# EAGLE schematic ArduFocuser V0.08 (EAGLE 6.3)
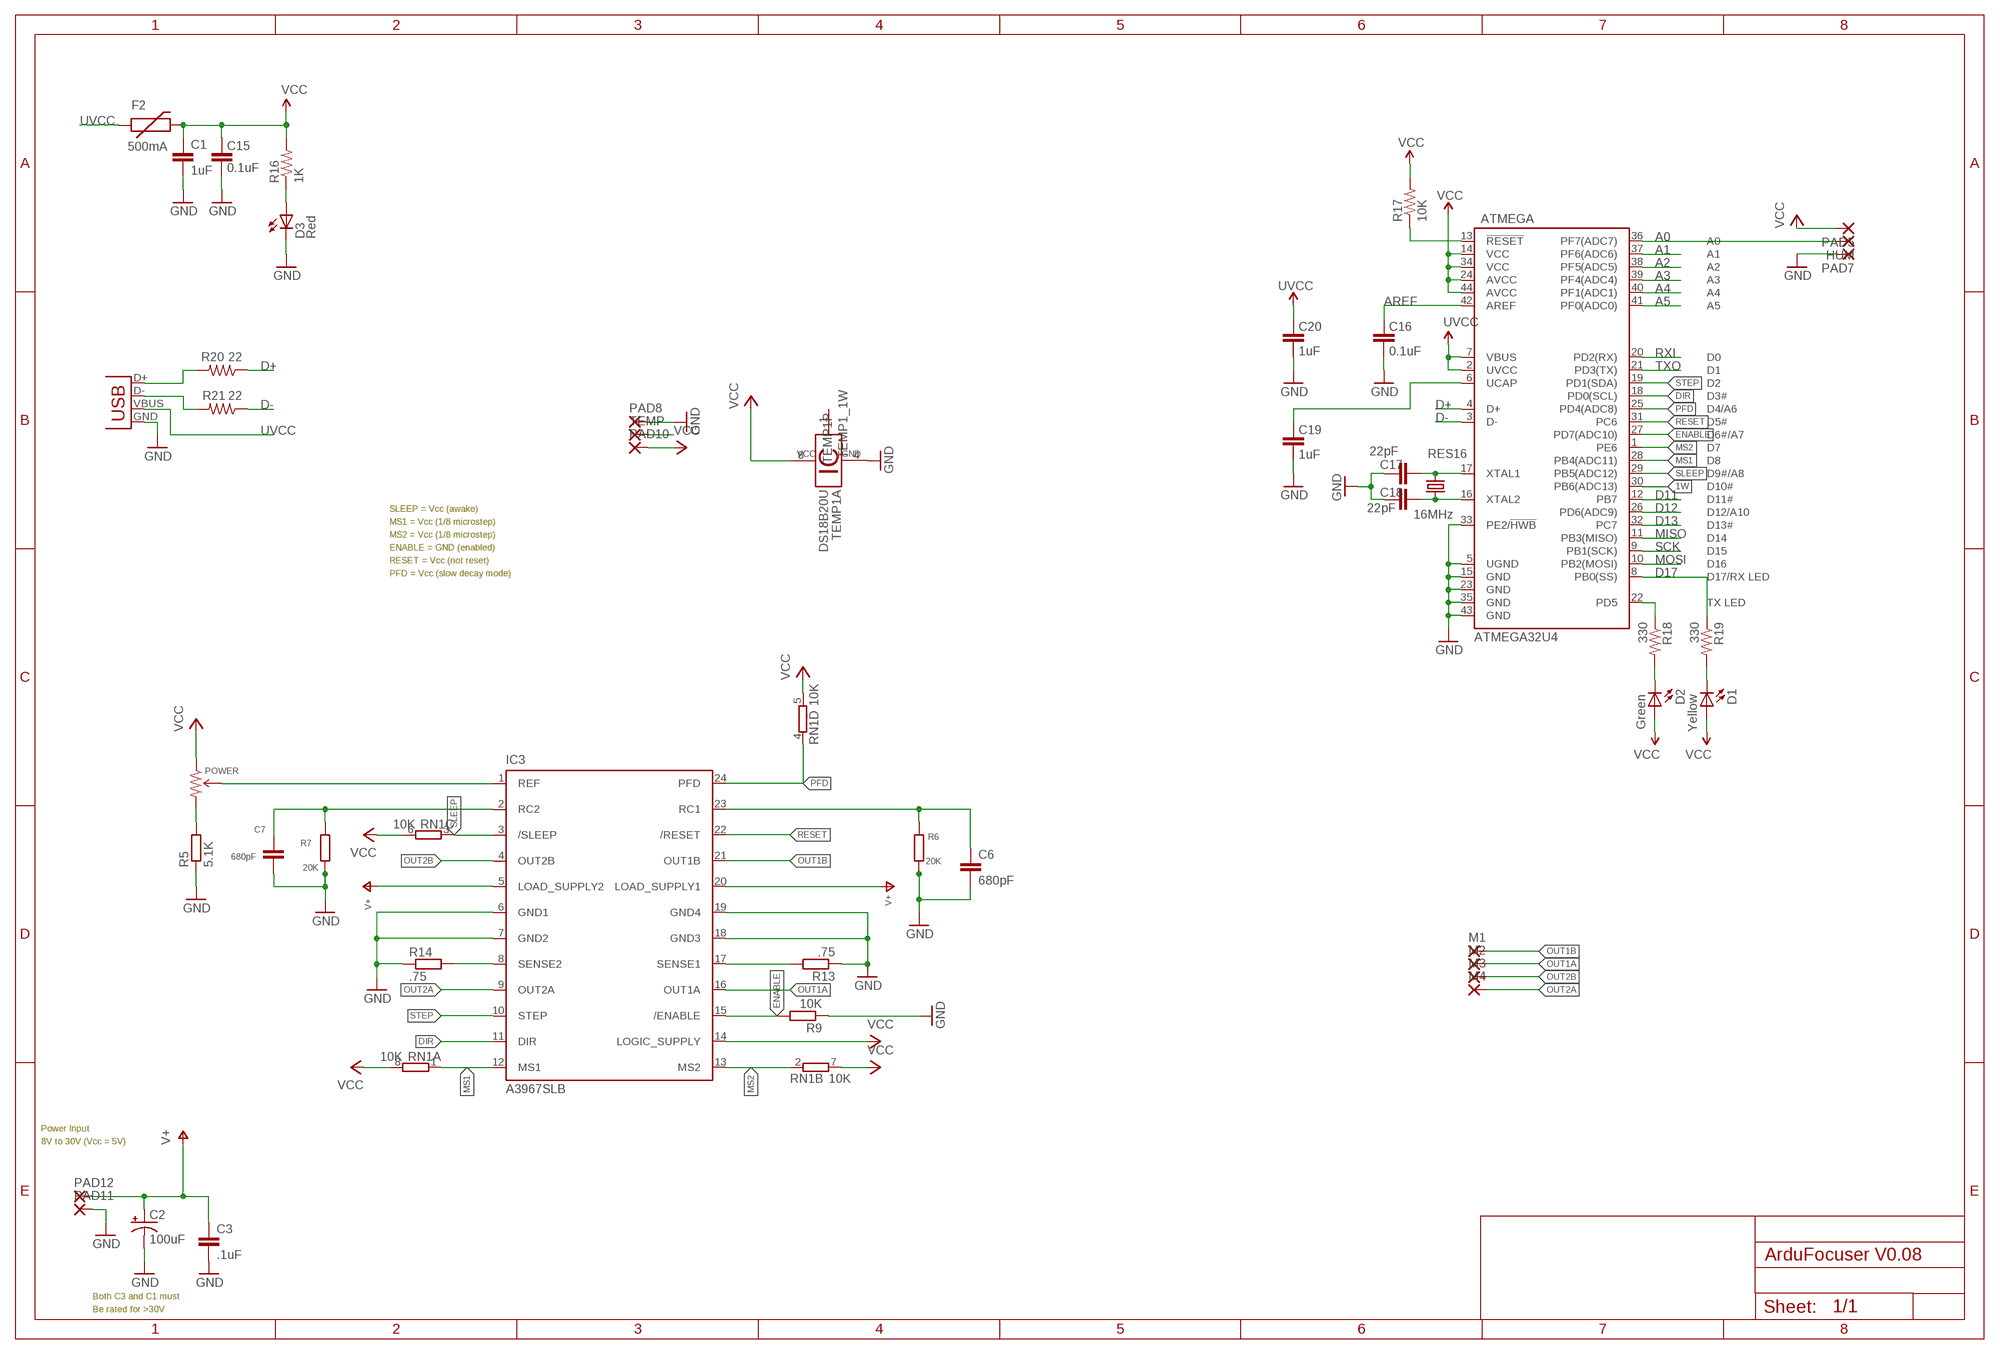
[diagram p0: schematic, sheet 1]

## Parts
ATMEGA  ATMEGA32U4  ATMEGA32U4QFN2  [QFN-44-NOPAD]
C1  1uF  CAP0805  [0805]
C2  100uF  CPOL-USD  [PANASONIC_D@1]
C3  .1uF  C-EUC0805  [C0805]
C6  680pF  C-EUC0805  [C0805]
C7  680pF  C-EUC0805  [C0805]
C15  0.1uF  CAP0805  [0805]
C16  0.1uF  CAP0805  [0805]
C17  22pF  CAP0805  [0805]
C18  22pF  CAP0402-CAP  [0402-CAP]
C19  1uF  CAP0805  [0805]
C20  1uF  CAP0805  [0805]
D1  Yellow  LED0603  [LED-0603]
D2  Green  LED0603  [LED-0603]
D3  Red  LED0603  [LED-0603]
F2  500mA  PTCSMD  [PTC-1206]
HUM  1,6/0,8  [1,6/0,8]
IC3  A3967SLB  [SO24W]
M1  SMD2  [SMD1,27-2,54]
M2  SMD2  [SMD1,27-2,54]
M3  SMD2  [SMD1,27-2,54]
M4  SMD2  [SMD1,27-2,54]
PAD5  1,6/0,8  [1,6/0,8]
PAD7  1,6/0,8  [1,6/0,8]
PAD8  1,6/0,8  [1,6/0,8]
PAD10  1,6/0,8  [1,6/0,8]
PAD11  2,15/1,0  [2,15/1,0]
PAD12  2,15/1,0  [2,15/1,0]
POWER  TRIMPOTSMD  [TRIMPOT-3MM]
R5  5.1K  R-EU_R0805  [R0805]
R6  20K  R-EU_R0805  [R0805]
R7  20K  R-EU_R0805  [R0805]
R9  10K  R-EU_R0805  [R0805]
R13  .75  R-EU_R0805  [R0805]
R14  .75  R-EU_R0805  [R0805]
R16  1K  RESISTOR0805-RES  [0805]
R17  10K  RESISTOR0402-RES  [0402-RES]
R18  330  RESISTOR0805-RES  [0805]
R19  330  RESISTOR0805-RES  [0805]
R20  22  RESISTOR0805-RES  [0805]
R21  22  RESISTOR0805-RES  [0805]
RES16  16MHz  CRYSTAL5X3  [CRYSTAL-SMD-5X3]
RN1  10K  4R-N0603-ARC  [0603-ARC]
TEMP  1,6/0,8  [1,6/0,8]
TEMP1  DS18B20U  [UMAX8]
USB  USB-MICROB  [USB-MICROB]

## Nets
1W: ATMEGA.30(PB6(ADC13)) TEMP.1(P)
A0: ATMEGA.36(PF7(ADC7)) HUM.1(P)
A1: ATMEGA.37(PF6(ADC6))
A2: ATMEGA.38(PF5(ADC5))
A3: ATMEGA.39(PF4(ADC4))
A4: ATMEGA.40(PF1(ADC1))
A5: ATMEGA.41(PF0(ADC0))
AREF: ATMEGA.42(AREF) C16.2
D11: ATMEGA.12(PB7)
D12: ATMEGA.26(PD6(ADC9))
D13: ATMEGA.32(PC7)
D17: ATMEGA.8(PB0(SS)) R19.1
D+: ATMEGA.4(D+) R20.1
D-: ATMEGA.3(D-) R21.1
DIR: ATMEGA.18(PD0(SCL)) IC3.11(DIR)
ENABLE: ATMEGA.27(PD7(ADC10)) IC3.15(/ENABLE) R9.2
GND: ATMEGA.5(UGND) ATMEGA.15(GND) ATMEGA.23(GND) ATMEGA.33(PE2/!HWB) ATMEGA.35(GND) ATMEGA.43(GND) C1.2 C2.- C3.2 C6.2 C7.2 C15.1 C16.1 C17.2 C18.2 C19.1 C20.1 D3.C IC3.6(GND1) IC3.7(GND2) IC3.18(GND3) IC3.19(GND4) PAD7.1(P) PAD8.1(P) PAD11.1(P) R5.1 R6.1 R7.1 R9.1 R13.1 R14.1 TEMP1.4 USB.GND
MISO: ATMEGA.11(PB3(MISO))
MOSI: ATMEGA.10(PB2(MOSI))
MS1: ATMEGA.28(PB4(ADC11)) IC3.12(MS1) RN1.1
MS2: ATMEGA.1(PE6) IC3.13(MS2) RN1.2
N$2: ATMEGA.16(XTAL2) C18.1 RES16.1
N$4: ATMEGA.17(XTAL1) C17.1 RES16.3
N$5: ATMEGA.6(UCAP) C19.2
N$7: R21.2 USB.D-
N$8: IC3.8(SENSE2) R14.2
N$9: IC3.17(SENSE1) R13.2
N$10: C7.1 IC3.2(RC2) R7.2
N$11: R20.2 USB.D+
N$12: D1.C R19.2
N$13: C6.1 IC3.23(RC1) R6.2
N$14: IC3.1(REF) POWER.2(WIPER)
N$15: D2.C R18.2
N$16: POWER.3(CW) R5.2
N$38: D3.A R16.1
OUT1A [MOTOR OUT]: IC3.16(OUT1A) M2.1(P)
OUT1B [MOTOR OUT]: IC3.21(OUT1B) M1.1(P)
OUT2A [MOTOR OUT]: IC3.9(OUT2A) M4.1(P)
OUT2B [MOTOR OUT]: IC3.4(OUT2B) M3.1(P)
PFD: ATMEGA.25(PD4(ADC8)) IC3.24(PFD) RN1.4
RESET: ATMEGA.13(!RESET) ATMEGA.31(PC6) IC3.22(/RESET) R17.1
RXI: ATMEGA.20(PD2(RX))
SCK: ATMEGA.9(PB1(SCK))
SLEEP: ATMEGA.29(PB5(ADC12)) IC3.3(/SLEEP) RN1.3
STEP: ATMEGA.19(PD1(SDA)) IC3.10(STEP)
TXLED1: ATMEGA.22(PD5) R18.1
TXO: ATMEGA.21(PD3(TX))
UVCC: ATMEGA.2(UVCC) ATMEGA.7(VBUS) C20.2 F2.1 USB.VBUS
V+ [power]: C2.+ C3.1 IC3.5(LOAD_SUPPLY2) IC3.20(LOAD_SUPPLY1) PAD12.1(P)
VCC: ATMEGA.14(VCC) ATMEGA.24(AVCC) ATMEGA.34(VCC) ATMEGA.44(AVCC) C1.1 C15.2 D1.A D2.A F2.2 IC3.14(LOGIC_SUPPLY) PAD5.1(P) PAD10.1(P) POWER.1(CCW) R16.2 R17.2 RN1.5 RN1.6 RN1.7 RN1.8 TEMP1.8

## Notes on the sheet
- SLEEP = Vcc (awake)
- MS1 = Vcc (1/8 microstep)
- MS2 = Vcc (1/8 microstep)
- ENABLE = GND (enabled)
- RESET = Vcc (not reset)
- PFD = Vcc (slow decay mode)
- Power Input
- 8V to 30V (Vcc = 5V)
- Both C3 and C1 must
- Be rated for >30V

## Power pins joined to a net without a drawn wire
1W: TEMP1.1

## Library data of the parts
ATMEGA = SparkFun:ATMEGA32U4
C1 C15-C20 = SparkFun:CAP: Capacitor Standard 0603 ceramic capacitor, and 0.1" leaded capacitor.
C2 = rcl:CPOL-US: POLARIZED CAPACITOR, American symbol
C3 C6 C7 = rcl:C-EU: CAPACITOR, European symbol
D1-D3 = SparkFun:LED: LEDs Standard schematic elements and footprints for 5mm, 3mm, 1206, and 0603 sized LEDs. 5mm - Spark Fun Electronics SKU : COM-00529 (and others)
F2 = SparkFun:PTC: Resettable Fuse PTC Resettable Fuse. Spark Fun Electronics SKU : COM-08357
HUM PAD5 PAD7 PAD8 PAD10 TEMP = wirepad:1,6/0,8: THROUGH-HOLE PAD
IC3 = Allegro:A3967SLB: ANALOG DEVICES
M1-M4 = wirepad:SMD2: SMD PAD
PAD11 PAD12 = wirepad:2,15/1,0: THROUGH-HOLE PAD
POWER = SparkFun:TRIMPOT
R5-R7 R9 R13 R14 = rcl:R-EU_: RESISTOR, European symbol
R16-R21 = SparkFun:RESISTOR: Resistor Basic schematic elements and footprints for 0603, 1206, and PTH resistors.
RES16 = SparkFun:CRYSTAL: Crystals Various standard crystals. Proven footprints. Spark Fun Electronics SKU : COM-00534
RN1 = resistor-dil:4R-N: Array Chip Resistor Source: RS Component / Phycomp; OC_FARNELL: unknown; OC_NEWARK: unknown
TEMP1 = 1wire:DS18B20: Programmable Resolution Digital Thermometer This chip provides a onewire thermosensor with approx. 0.5°C accuracy. A programmable over/undertemperure alarm is available. The precision can be set from 9..12 bits. Notes: Vdd must be applied for accurate measurements at low temperatures, as the parasite power circuit otherwise heats the sensor. If parasite power is used, Vdd has to be connected to GND. The DS1822 is a low-cost thermometer chip, the DS18S20 is similar to the DS18B20, but with 9 Bit precision only. Author: Jan Kandziora <jjj@gmx.de>
USB = SparkFun:USB: USB Connectors USB-B-PTH is fully proven SKU : PRT-00139 USB-miniB is fully proven SKU : PRT-00587 USB-A-PCB is untested. USB-A-H is throughly reviewed, but untested. Spark Fun Electronics SKU : PRT-00437 USB-B-SMT is throughly reviewed, but untested. Needs silkscreen touching up. USB-A-S has not been used/tested USB-MB-H has not been used/tested

## Net classes
0 default: width 0.152 mm
1 power: width 0.762 mm
2 MOTOR OUT: width 0.508 mm
3 usbvcc: width 0.152 mm
4 aref: width 0.152 mm